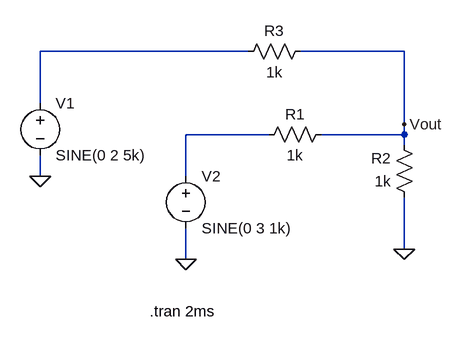
[diagram p0: schematic figure2.asc]
figure2.asc, the LTspice schematic file:
Version 4
SHEET 1 880 680
WIRE 160 32 -160 32
WIRE 400 32 240 32
WIRE -160 112 -160 32
WIRE 400 144 400 32
WIRE 192 160 64 160
WIRE 400 160 400 144
WIRE 400 160 272 160
WIRE 400 176 400 160
WIRE -160 224 -160 192
WIRE 64 224 64 160
WIRE 400 336 400 256
WIRE 64 352 64 304
FLAG 400 336 0
FLAG -160 224 0
FLAG 64 352 0
FLAG 400 144 Vout
SYMBOL voltage -160 96 R0
WINDOW 123 0 0 Left 0
WINDOW 39 0 0 Left 0
SYMATTR InstName V1
SYMATTR Value SINE(0 2 5k)
SYMBOL res 256 16 R90
WINDOW 0 0 56 VBottom 2
WINDOW 3 32 56 VTop 2
SYMATTR InstName R3
SYMATTR Value 1k
SYMBOL res 416 272 R180
WINDOW 0 36 76 Left 2
WINDOW 3 36 40 Left 2
SYMATTR InstName R2
SYMATTR Value 1k
SYMBOL voltage 64 208 R0
WINDOW 123 0 0 Left 0
WINDOW 39 0 0 Left 0
SYMATTR InstName V2
SYMATTR Value SINE(0 3 1k)
SYMBOL res 288 144 R90
WINDOW 0 0 56 VBottom 2
WINDOW 3 32 56 VTop 2
SYMATTR InstName R1
SYMATTR Value 1k
TEXT 8 432 Left 2 !.tran 2ms

The netlist it stands for:
* figure2.asc
V1 N001 0 SINE(0 2 5k)
R3 Vout N001 1k
R2 0 Vout 1k
V2 N002 0 SINE(0 3 1k)
R1 Vout N002 1k
.tran 2ms
.backanno
.end